# EAGLE design cyrf69103-bob (EAGLE 6.4)
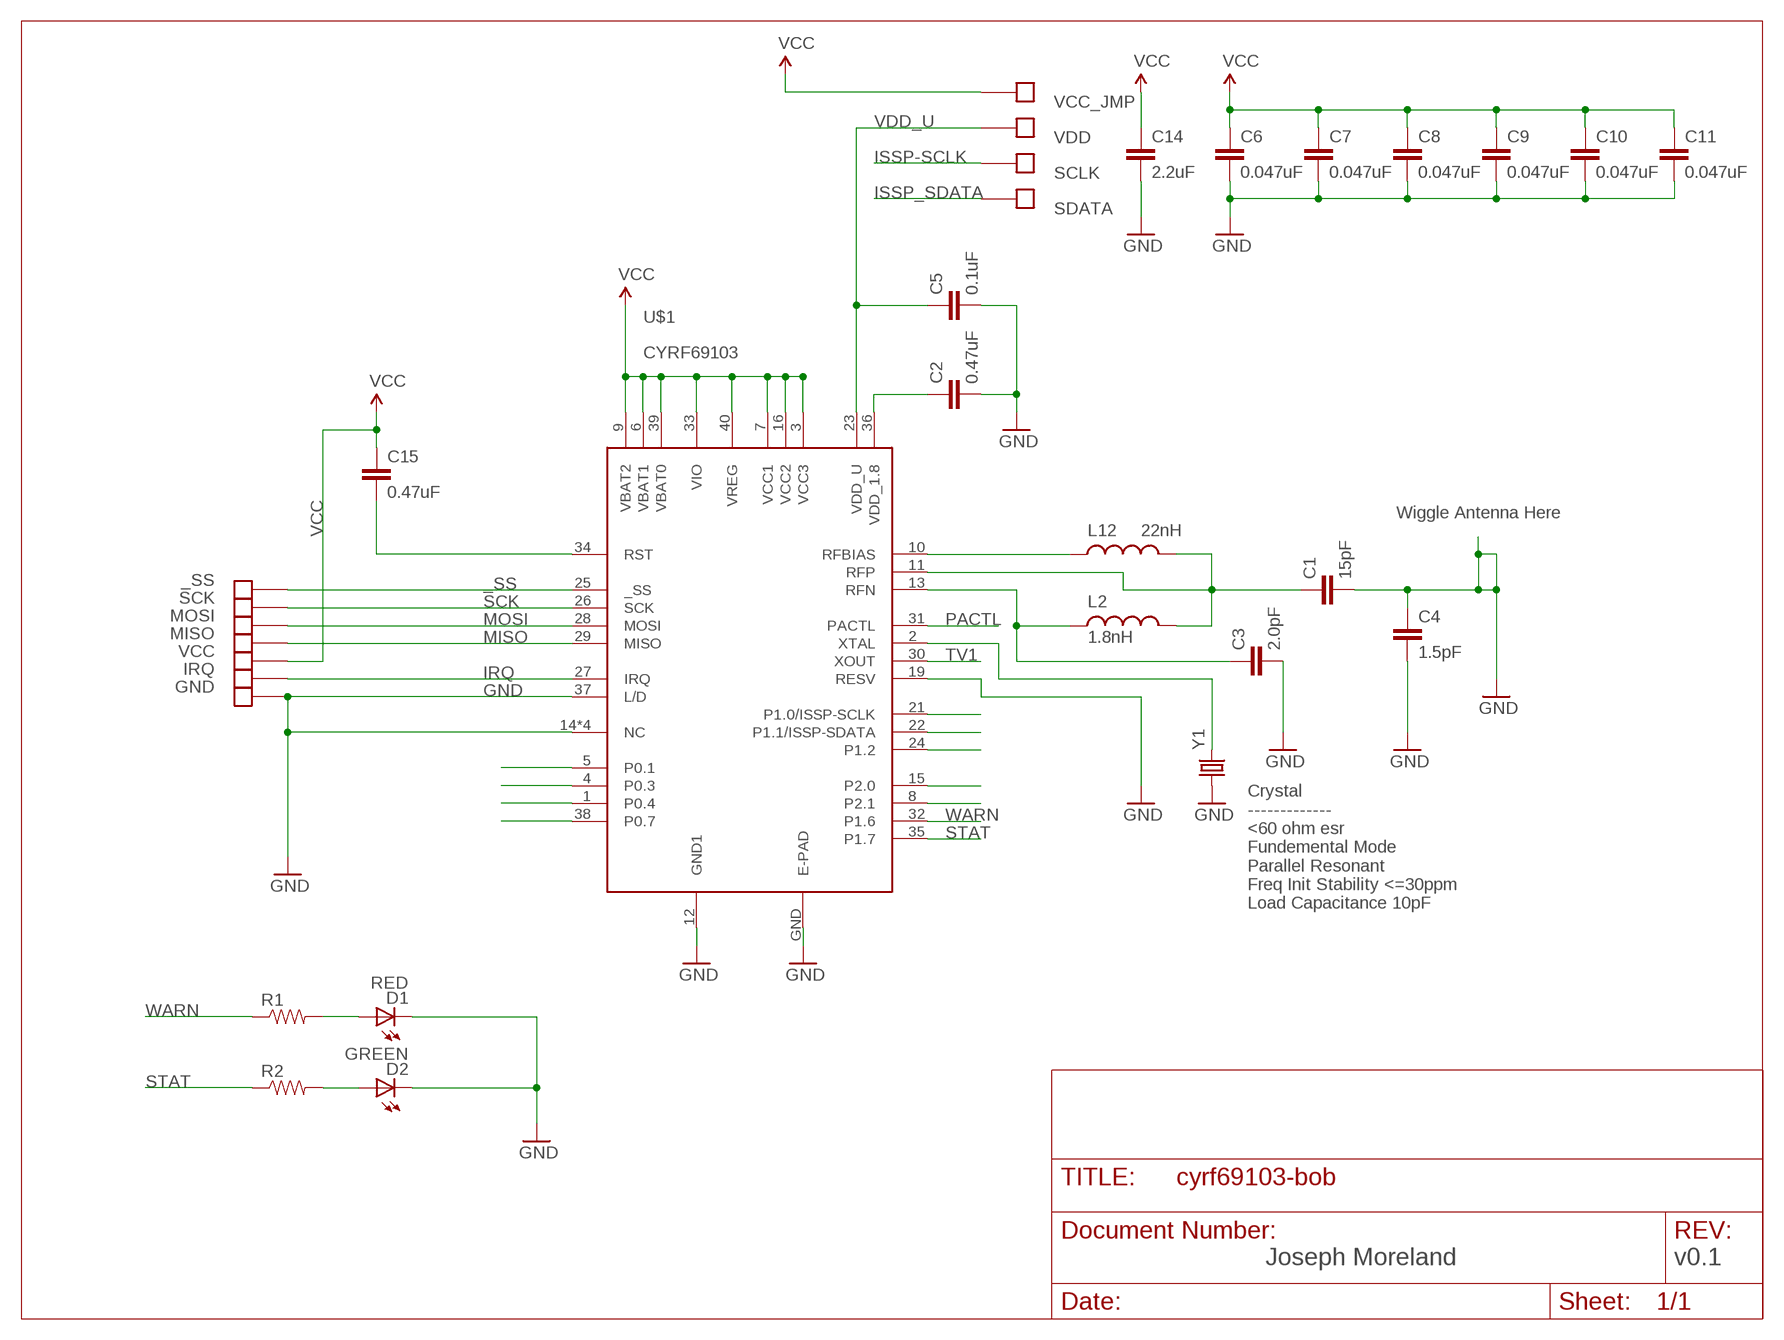
[diagram p0: schematic, sheet 1]

## Parts
_SS  SOLDER_PAD  [SOLDER_PAD]
C1  15pF  CAP0402-CAP  [0402-CAP]
C2  0.47uF  CAP0402-CAP  [0402-CAP]
C3  2.0pF  CAP0402-CAP  [0402-CAP]
C4  1.5pF  CAP0402-CAP  [0402-CAP]
C5  0.1uF  CAP0402-CAP  [0402-CAP]
C6  0.047uF  CAP0402-CAP  [0402-CAP]
C7  0.047uF  CAP0402-CAP  [0402-CAP]
C8  0.047uF  CAP0402-CAP  [0402-CAP]
C9  0.047uF  CAP0402-CAP  [0402-CAP]
C10  0.047uF  CAP0402-CAP  [0402-CAP]
C11  0.047uF  CAP0402-CAP  [0402-CAP]
C14  2.2uF  CAP0805  [0805]
C15  0.47uF  CAP0402-CAP  [0402-CAP]
D1  RED  LED-RED0603  [LED-0603]
D2  GREEN  LED-GREEN0603  [LED-0603]
GND  SOLDER_PAD  [SOLDER_PAD]
IRQ  SOLDER_PAD  [SOLDER_PAD]
L2  1.8nH  INDUCTOR0402  [C0402]
L12  22nH  INDUCTOR0603  [0603]
MISO  SOLDER_PAD  [SOLDER_PAD]
MOSI  SOLDER_PAD  [SOLDER_PAD]
R1  RESISTOR0402-RES  [0402-RES]
R2  RESISTOR0402-RES  [0402-RES]
SCK  SOLDER_PAD  [SOLDER_PAD]
SCLK  SOLDER_PAD  [SOLDER_PAD]
SDATA  SOLDER_PAD  [SOLDER_PAD]
U$1  CYRF69103  [QFN40]
VCC  SOLDER_PAD  [SOLDER_PAD]
VCC_JMP  SOLDER_PAD  [SOLDER_PAD]
VDD  SOLDER_PAD  [SOLDER_PAD]
Y1  CRYSTAL5X3  [CRYSTAL-SMD-5X3]

## Nets
_SS: _SS.SPAD(NET) U$1.25(_SS)
GND: C1.2 C2.2 C3.2 C4.1 C4.2 C5.2 C6.2 C7.2 C8.2 C9.2 C10.2 C11.2 C14.2 D1.C D2.C GND.SPAD(NET) U$1.12(GND1) U$1.14(NC) U$1.17(NC) U$1.18(NC) U$1.20(NC) U$1.37(L/D) U$1.GND(E-PAD) Y1.1
IRQ: IRQ.SPAD(NET) U$1.27(IRQ)
ISSP-SCLK: SCLK.SPAD(NET) U$1.21(P1.0/ISSP-SCLK)
ISSP_SDATA: SDATA.SPAD(NET) U$1.22(P1.1/ISSP-SDATA)
MISO: MISO.SPAD(NET) U$1.29(MISO)
MOSI: MOSI.SPAD(NET) U$1.28(MOSI)
N$1: D1.A R1.2
N$2: U$1.2(XTAL) Y1.3
N$3: U$1.5(P0.1)
N$4: U$1.4(P0.3)
N$5: U$1.1(P0.4)
N$6: U$1.38(P0.7)
N$7: U$1.24(P1.2)
N$8: U$1.15(P2.0)
N$9: U$1.8(P2.1)
N$10: D2.A R2.2
PACTL: U$1.31(PACTL)
RFBIAS: L12.1 U$1.10(RFBIAS)
RFN: C3.1 L2.1 U$1.13(RFN)
RFP: C1.1 L2.2 L12.2 U$1.11(RFP)
RST: C15.2 U$1.34(RST)
SCK: SCK.SPAD(NET) U$1.26(SCK)
STAT: R2.1 U$1.35(P1.7)
VCC: C6.1 C7.1 C8.1 C9.1 C10.1 C11.1 C14.1 C15.1 U$1.3(VCC3) U$1.6(VBAT1) U$1.7(VCC1) U$1.9(VBAT2) U$1.16(VCC2) U$1.33(VIO) U$1.39(VBAT0) U$1.40(VREG) VCC.SPAD(NET) VCC_JMP.SPAD(NET)
VDD_1.8: C2.1 U$1.36(VDD_1.8)
VDD_U: C5.1 U$1.23(VDD_U) VDD.SPAD(NET)
WARN: R1.1 U$1.32(P1.6)
Unconnected: U$1.19(RESV) U$1.30(XOUT)

## Notes on the sheet
- Wiggle Antenna Here
- Crystal
  -------------
  <60 ohm esr
  Fundemental Mode
  Parallel Resonant
  Freq Init Stability <=30ppm
  Load Capacitance 10pF
- Joseph Moreland | v0.1

## Library data of the parts
_SS GND IRQ MISO MOSI SCK SCLK SDATA VCC VCC_JMP VDD = JCM:SOLDER_PAD
C1 = SparkFun-Passives:CAP: Capacitor Standard 0603 ceramic capacitor, and 0.1" leaded capacitor.; PARTNO: C0402C150J5GACTU; VOLT: 50
C2 C5 C15 = SparkFun-Passives:CAP: Capacitor Standard 0603 ceramic capacitor, and 0.1" leaded capacitor.; PARTNO: GRM155R60J474KE19D; VOLT: 6.3
C3 = SparkFun-Passives:CAP: Capacitor Standard 0603 ceramic capacitor, and 0.1" leaded capacitor.; PARTNO: C0402C209C5GACTU; VOLT: 50
C4 = SparkFun-Passives:CAP: Capacitor Standard 0603 ceramic capacitor, and 0.1" leaded capacitor.; PARTNO: C0402C159B5GACTU; VOLT: 50
C6-C11 = SparkFun-Passives:CAP: Capacitor Standard 0603 ceramic capacitor, and 0.1" leaded capacitor.; PARTNO: 0402YD473KAT2A
C14 = SparkFun-Passives:CAP: Capacitor Standard 0603 ceramic capacitor, and 0.1" leaded capacitor.; PARTNO: GRM21BR71A225KA01L
D1 = SparkFun-LED:LED-RED: Assorted Red LEDs LilyPad 1206- DIO-09912 1206- DIO-00809 0603- DIO-00819; PROD_ID: DIO-00819
D2 = SparkFun-LED:LED-GREEN: Various green LEDs 0603- DIO-00821 LARGE- DIO-00862 LILYPAD- DIO-09910; PROD_ID: DIO-00821
L2 = SparkFun-Passives:INDUCTOR: Inductors Basic Inductor/Choke - 0603 and 1206. Footprints are not proven and vary greatly between part numbers.; PARTNO: ELJ-RF1N8DFB
L12 = SparkFun-Passives:INDUCTOR: Inductors Basic Inductor/Choke - 0603 and 1206. Footprints are not proven and vary greatly between part numbers.; PARTNO: ELJ-RE22NGFA
R1 R2 = SparkFun-Passives:RESISTOR: Resistor Basic schematic elements and footprints for 0603, 1206, and PTH resistors.
U$1 = JCM:CYRF69103
Y1 = SparkFun-FreqCtrl:CRYSTAL: Various standard crystals. Proven footprints. Spark Fun Electronics SKU : COM-00534; PARTNO: 7B-12.000MEEQ-T

## Board
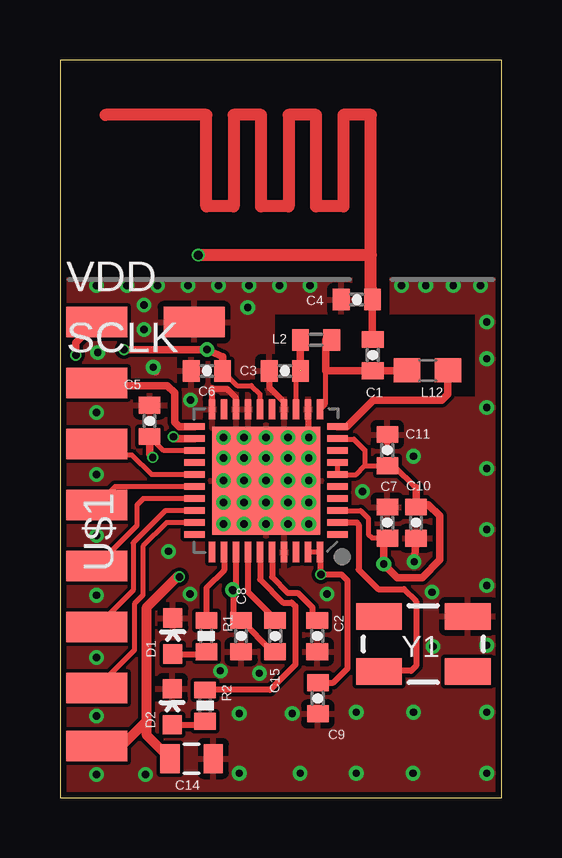
[diagram p1: board, top side]
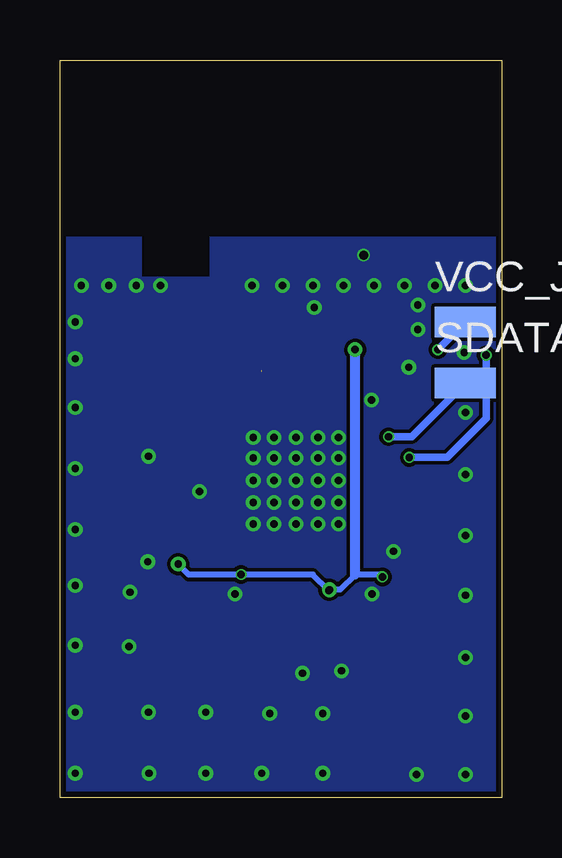
[diagram p2: board, bottom side, seen from below]

Size 18.41 x 30.73 mm. Coordinates in mm from the lower left corner, seen from the top.
Outline: 0,0 18.41,0 18.41,30.73 0,30.73 0,0
Copper layers (1*16): Top 0.035mm / dielectric 1.5mm / Bottom 0.035mm
Design rules "Fusion_eagle_rule_v1.1-JCM-restring *": minimum track width 6mil, minimum drill 12mil, track to track 6mil, track to pad 6mil, pad to pad 6mil, via to via 6mil, smd to smd 0mil, copper to edge 10mil, drill to drill 10mil, minimum pad ring 10mil, minimum via ring 2mil, stop-mask expansion 2mil, vias tented up to drill 100mil, thermal gap 10mil
tRestrict: area 9,16.7 to 17.3,20.1; area 12.2,20.1 to 13.7,21.8
bRestrict: area 12.2,21.7 to 15,23.4

### Footprints (pad centres in the part's own frame; a part is rotated, then mirrored left to right if it is on the bottom)
SOLDER_PAD = smd 2.54 x 1.27: SPAD 0,0
0402-CAP = smd 0.7 x 0.9: 1 -0.65,0; 2 0.65,0
0805 = smd 0.8 x 1.2: 1 -0.9,0; 2 0.9,0
LED-0603 = smd 0.8 x 0.8: A 0,-0.75; C 0,0.75
C0402 = smd 0.7 x 0.9: 1 -0.65,0; 2 0.65,0
0603 = smd 1.1 x 1: 1 -0.85,0; 2 0.85,0
0402-RES = smd 0.7 x 0.9: 1 -0.65,0; 2 0.65,0
QFN40 = smd 0.28 x 0.85: 1 -2.25,-2.975; 2 -1.75,-2.975; 3 -1.25,-2.975; 4 -0.75,-2.975; 5 -0.25,-2.975; 6 0.25,-2.975; 7 0.75,-2.975; 8 1.25,-2.975; 9 1.75,-2.975; 10 2.25,-2.975; 21 2.25,2.975; 22 1.75,2.975; 23 1.25,2.975; 24 0.75,2.975; 25 0.25,2.975; 26 -0.25,2.975; 27 -0.75,2.975; 28 -1.25,2.975; 29 -1.75,2.975; 30 -2.25,2.975 | smd 0.85 x 0.28: 11 2.975,-2.25; 12 2.975,-1.75; 13 2.975,-1.25; 14 2.975,-0.75; 15 2.975,-0.25; 16 2.975,0.25; 17 2.975,0.75; 18 2.975,1.25; 19 2.975,1.75; 20 2.975,2.25; 31 -2.975,2.25; 32 -2.975,1.75; 33 -2.975,1.25; 34 -2.975,0.75; 35 -2.975,0.25; 36 -2.975,-0.25; 37 -2.975,-0.75; 38 -2.975,-1.25; 39 -2.975,-1.75; 40 -2.975,-2.25 | smd 4.5 x 4.5: GND 0,0
CRYSTAL-SMD-5X3 = smd 1.9 x 1.1: 1 -1.85,-1.15; 2 1.85,-1.15; 3 1.85,1.15; 4 -1.85,1.15

### Placement (x,y rotation side)
_SS  1.52,14.73 0 top
C1  13.03,18.44 90 top
C2  10.72,6.73 270 top
C3  9.37,17.78 180 top
C4  12.37,20.75 180 top
C5  3.73,15.7 90 top
C6  6.12,17.78 180 top
C7  13.64,11.46 90 top
C8  7.54,6.73 270 top
C9  10.74,4.14 270 top
C10  14.83,11.46 270 top
C11  13.64,14.48 90 top
C14  5.49,1.63 0 top
C15  8.97,6.73 90 top
D1  4.7,6.73 0 top
D2  4.67,3.78 0 top
GND  5.59,19.81 0 top
IRQ  1.52,9.65 0 top
L2  10.67,19.08 0 top
L12  15.32,17.81 180 top
MISO  1.52,4.57 0 top
MOSI  1.52,7.11 0 top
R1  6.1,6.73 270 top
R2  6.05,3.84 270 top
SCK  1.52,12.19 0 top
SCLK  1.52,17.27 0 top
SDATA  1.52,17.27 0 bottom
U$1  8.59,13.21 90 top
VCC  1.52,2.16 0 top
VCC_JMP  1.52,19.81 0 bottom
VDD  1.52,19.81 0 top
Y1  15.14,6.4 180 top

### Tracks (layer width: path | path; a pad name or v marks a point on that pad's centre or on a via)
_SS
  Top 0.203: _SS.SPAD 1.98,14.27 3,14.27 3.81,13.46 U$1.25
GND  (via drill 0.3 pad 0.61, 0.38 pad 0.51)
  Top 0: 12.95,21.21 12.95,20.82 C4.1
  Top 0.254: C7.2 13.64,12.2 | U$1.18 7.34,16.64 6.96,17.02 6.4,17.02 6.35,17.07 | U$1.20 6.35,16.2 6.35,17.02 | U$1.14 9.34,16.47 8.74,17.07 8.74,17.77 | U$1.12 10.34,15.04 v10.36,15.01
  Top 0.305: C10.2 v14.76,9.83 | 3.99,17.75 3.96,17.78 | 8.74,17.77 C3.2 | C1.2 C4.1 | 13.63,14.83 C11.2
  Top 0.508: 12.95,21.21 12.95,22.61 | 12.95,22.61 12.95,28.45 11.81,28.45 11.81,24.64 10.67,24.64 10.67,28.45 9.52,28.45 9.52,24.64 8.38,24.64 8.38,28.45 7.24,28.45 7.24,24.64 6.1,24.64 6.1,28.45 1.9,28.45 | 12.95,22.61 v5.77,22.61
  other vias: 5.41,8.48 4.52,10.26 10.36,13.21 9.5,13.21 8.59,13.21 7.67,13.21 6.81,13.21 10.36,12.29 9.5,12.29 8.59,12.29 7.67,12.29 6.81,12.29 10.36,11.4 9.5,11.4 8.59,11.4 7.67,11.4 6.81,11.4 7.67,14.15 6.81,14.15 6.81,15.01 3.89,17.93 9.68,3.51 8.31,5.18 1.52,3.4 1.52,5.84 1.52,8.43 1.52,10.92 1.52,13.46 1.52,16.05 1.52,21.34 1.52,0.97 15.24,21.34 14.22,21.34 10.41,21.34 9.14,21.34 2.79,21.34 7.87,21.34 6.6,21.34 5.33,21.34 4.06,21.34 17.53,21.34 14.71,1.02 16.38,21.34 3.56,0.97 7.47,1.02 10.01,1.02 7.47,3.51 12.34,1.02 5.44,16.56 3.51,19.51 3.51,20.52 15.49,8.56 12.34,3.56 14.73,3.56 7.82,20.42 1.57,18.54 14.73,14.22 17.78,3.56 17.78,6.35 17.78,8.84 17.78,11.18 17.78,13.72 17.78,16.26 17.78,1.02 17.78,18.29 17.78,19.81 15.54,6.3 6.68,5.28 11.13,8.48 8.59,14.15 9.5,14.15 10.36,14.15 7.67,15.01 8.59,15.01 9.5,15.01 12.6,12.75
  pour Bottom: -0.63,0 18.41,0 18.41,23.32 -0.63,23.32
  pour Top (rank 2): 0,0 18.41,0 18.41,21.59 0,21.59
IRQ
  Top 0.203: U$1.27 3.47,12.46 3.2,12.19 3.2,11.33 IRQ.SPAD
ISSP-SCLK
  Top 0.305: U$1.21 4.96,15.46 4.77,15.65 4.77,16.87 4.47,17.17 1.63,17.17 SCLK.SPAD
ISSP_SDATA  (via drill 0.3)
  Top 0.305: U$1.22 4.8,14.96 v4.72,15.04
  Bottom 0.305: v4.72,15.04 3.76,15.04 SDATA.SPAD
MISO
  Top 0.203: U$1.29 4.45,11.46 3.45,10.46 3.45,8.43 3.1,8.08 3.1,6.15 MISO.SPAD
MOSI
  Top 0.203: U$1.28 4.39,11.96 3.05,10.62 3.05,8.64 MOSI.SPAD
N$1
  Top 0.254: D1.A 6,5.98 R1.2
N$2
  Top 0.254: Y1.3 13.32,5.28 14.63,5.28 14.83,5.49 14.83,8.18 14.33,8.69 13.26,8.69 12.45,9.5 12.45,11.38 12.37,11.46 U$1.2
N$10
  Top 0.254: D2.A 5.89,3.04 R2.2
RFBIAS
  Top 0.305: 16.56,17.79 L12.1 16.15,17.79 16.15,16.82 15.9,16.56 13.06,16.56 11.95,15.46 U$1.10
RFN  (1 unrouted)
  Top 0.203: U$1.13 9.84,17.59 C3.1
  Top 0.305: C3.1 L2.1
  Top 0.508: 10.06,19.07 L2.1
RFP
  Top 0.203: U$1.11 11.06,16.41 11.06,18.29
  Top 0.305: 11.06,19.07 11.06,18.92 | 11.06,18.92 11.06,18.29 11.06,17.79 C1.1 | C1.1 | L2.2 11.22,19.07 11.06,18.92 | C1.1 14.45,17.79 L12.2
RST
  Top 0.254: U$1.34 7.82,10.22 7.82,8.59 8.97,7.44 C15.2
SCK
  Top 0.203: 2.63,11.84 1.77,12.7 | U$1.26 2.29,12.96 SCK.SPAD
  Top 0.254: 1.77,12.7 SCK.SPAD
STAT
  Top 0.254: U$1.35 8.34,9.09 9.3,8.13 9.65,8.13 9.8,7.98 9.8,5.54 8.75,4.49 R2.1
VCC  (via drill 0.3, 0.3 pad 0.61)
  Top 0.203: C6.1 7.38,17.17 7.98,17.17 8.34,16.81 U$1.16 | U$1.9 11.58,14.93 12.24,14.93 12.7,14.48 12.7,13.82 | U$1.7 U$1.6 12.34,13.46 12.7,13.82 | 12.7,13.82 13.63,13.82 C11.1 | U$1.3 12.53,11.96 12.85,11.63 12.85,10.97 13,10.82 13.62,10.82 C7.1 | U$1.40 U$1.39
  Top 0.254: 13.47,13.7 C11.1 | C7.1 13.63,10.9 13.49,10.9 | 15.35,12.21 C10.1 | 13.51,13.7 C11.1 | 14.83,12.9 13.91,13.83 C11.1 | U$1.33 7.31,10.21 7.31,8.79 v7.19,8.66 | v7.21,8.64 7.21,7.71 C8.1 8.84,6.08 C15.1 | U$1.40 10.84,9.33 v10.87,9.3 11.73,9.3 11.99,9.04 11.99,5.38 11.39,4.79 C9.1
  Top 0.305: C10.1 14.83,12.9 | 15.35,12.21 15.82,11.73 15.82,9.91 15.09,9.17 14.05,9.17 v13.49,9.73 13.49,10.9 | C6.1 6.77,18.38 v6.12,18.67 v2.67,18.67 | VCC.SPAD 2.58,2.16
  Top 0.406: 3.62,3.2 2.58,2.16 | 3.62,3.2 3.62,7.94 4.88,9.2 v4.98,9.2 | C14.1 3.62,2.59 3.62,3.2
  Bottom 0.254: v4.98,9.2 5.08,9.3 6.12,9.3 6.76,8.66 v7.19,8.66 v7.21,8.64 7.87,9.3 v10.87,9.3 13.06,9.3 v13.49,9.73
  Bottom 0.305: v2.67,18.67 VCC_JMP.SPAD
  Bottom 0.406: 6.12,9.3 v6.12,18.67
VDD_1.8
  Top 0.254: U$1.36 8.84,9.2 9.5,8.53 9.91,8.53 10.52,7.93 10.52,7.58 C2.1
VDD_U  (via drill 0.3)
  Top 0.203: U$1.23 4.32,14.46 C5.1
  Top 0.305: C5.1 3.73,14.3 v3.86,14.17 | v0.66,18.44 0.66,18.95 VDD.SPAD
  Bottom 0.305: v3.86,14.17 2.29,14.17 0.66,15.8 v0.66,18.44
WARN
  Top 0.254: U$1.32 6.83,9.48 6.1,8.74 R1.1

### Text on the board
tDocu: CYRF69103-BoB v0.1
bDocu: J Moreland Engineering LLC / 22 Apr 2013